# Altium schematic sheet MeasurementCircuit.SchDoc
size 322 x 215 mm; SheetNumber: 2; SheetTotal: 2
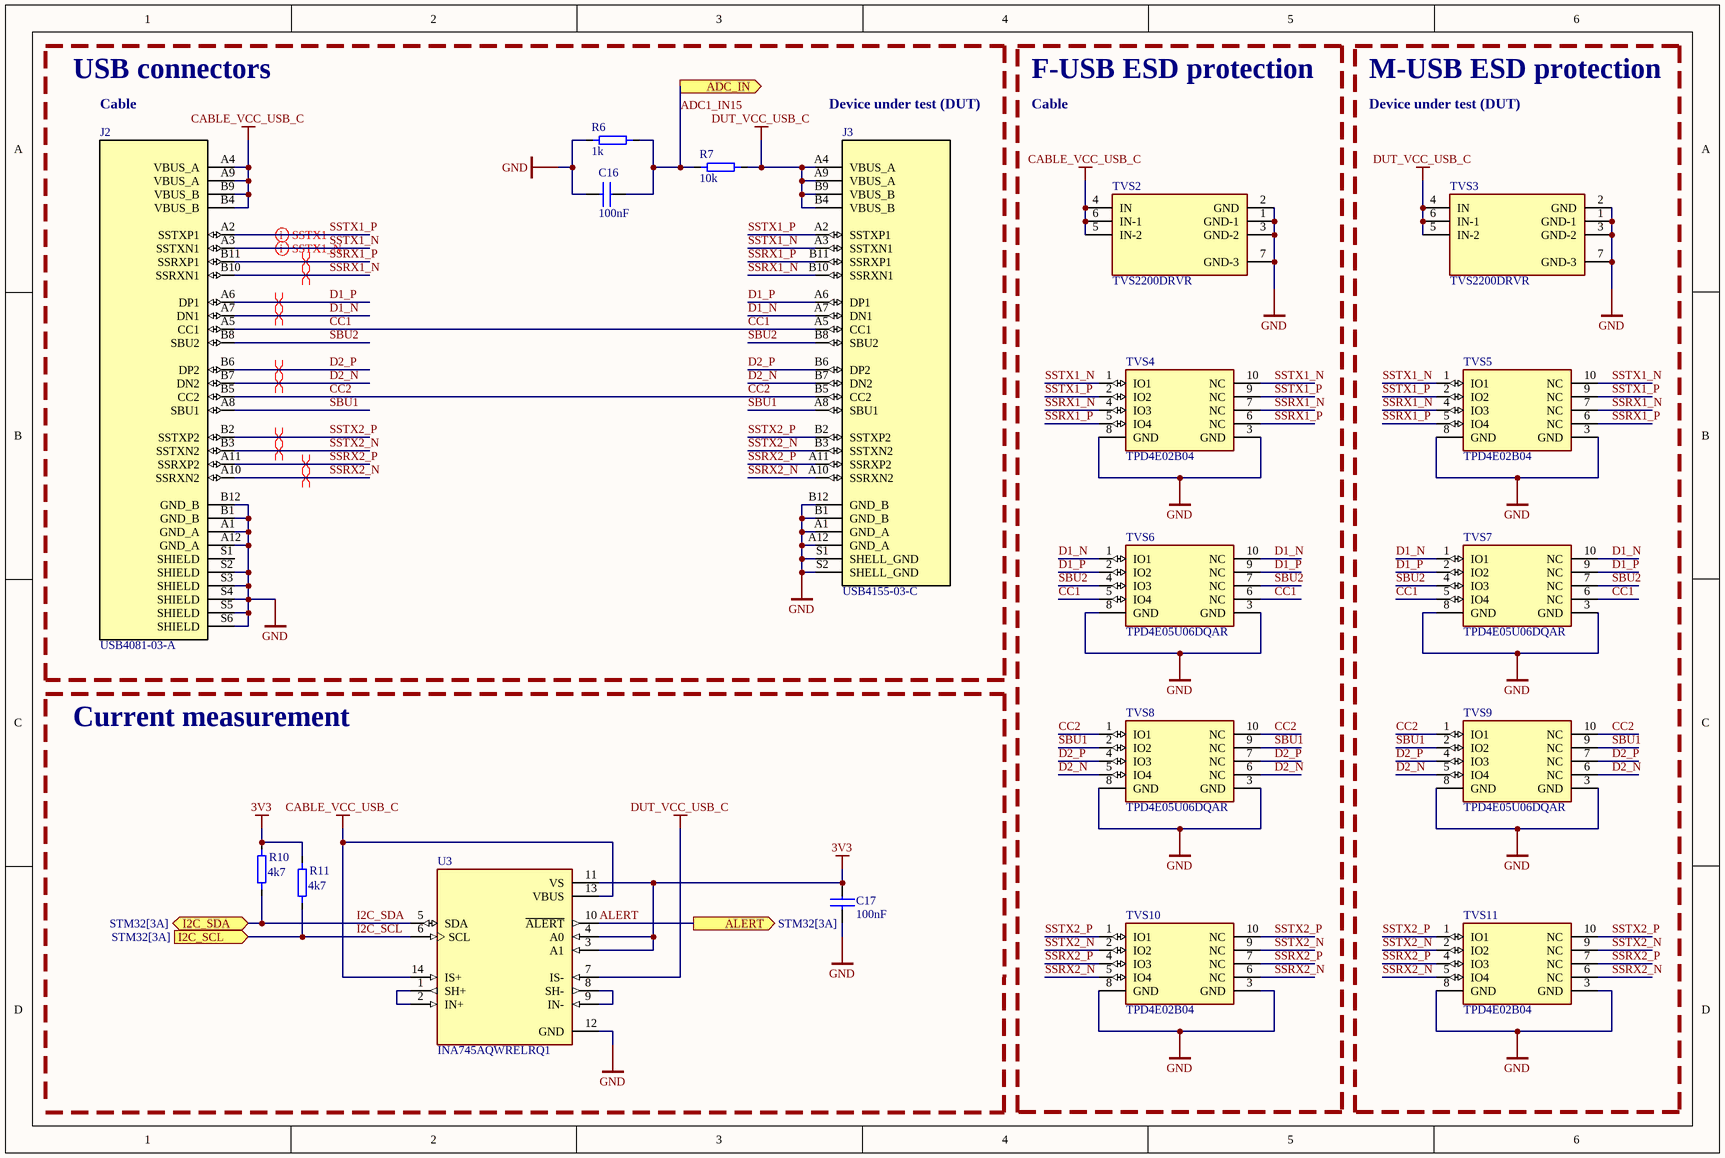
[diagram p0: MeasurementCircuit.SchDoc]

## Parts
C16  100nF  [C0402]
C17  100nF  [C0402]
J2  USB4081-03-A  [USB4081-03-A]
J3  USB4155-03-C  [USB4155-03-C]
R6  1k  [R0402]
R7  10k  [R0603]
R10  4k7  [R0402]
R11  4k7  [R0402]
TVS2  TVS2200DRVR  [TVS2200DRVR]
TVS3  TVS2200DRVR  [TVS2200DRVR]
TVS4  TPD4E02B04  [TPD4E02B04]
TVS5  TPD4E02B04  [TPD4E02B04]
TVS6  TPD4E05U06DQAR  [TPD4E05U06DQAR]
TVS7  TPD4E05U06DQAR  [TPD4E05U06DQAR]
TVS8  TPD4E05U06DQAR  [TPD4E05U06DQAR]
TVS9  TPD4E05U06DQAR  [TPD4E05U06DQAR]
TVS10  TPD4E02B04  [TPD4E02B04]
TVS11  TPD4E02B04  [TPD4E02B04]
U3  INA745AQWRELRQ1  [INA745AQWRELRQ1]

## Blocks framed on the sheet
USB connectors: C16 J2 J3 R6 R7
F-USB ESD protection: TVS2 TVS4 TVS6 TVS8 TVS10
M-USB ESD protection: TVS3 TVS5 TVS7 TVS9 TVS11

## Ports
ADC_IN (out, see STM32[2B]), ALERT (out, see STM32[3A]), I2C_SCL (in, see STM32[3A]), I2C_SDA (bidir, see STM32[3A])

## Nets
3V3: C17.1 R10.1 R11.1 U3.3(A1) U3.4(A0) U3.11(VS)
CABLE_VCC_USB_C: J2.A4(VBUS_A) J2.A9(VBUS_A) J2.B4(VBUS_B) J2.B9(VBUS_B) TVS2.4(IN) TVS2.5(IN-2) TVS2.6(IN-1) U3.13(VBUS) U3.14(IS+)
DUT_VCC_USB_C: J3.A4(VBUS_A) J3.A9(VBUS_A) J3.B4(VBUS_B) J3.B9(VBUS_B) R7.2 TVS3.4(IN) TVS3.5(IN-2) TVS3.6(IN-1) U3.7(IS-)
GND: C16.2 C17.2 J2.A1(GND_A) J2.A12(GND_A) J2.B1(GND_B) J2.B12(GND_B) J2.S2(SHIELD) J2.S3(SHIELD) J2.S4(SHIELD) J2.S5(SHIELD) J2.S6(SHIELD) J3.A1(GND_A) J3.A12(GND_A) J3.B1(GND_B) J3.B12(GND_B) J3.S1(SHELL_GND) J3.S2(SHELL_GND) R6.1 TVS2.1(GND-1) TVS2.2(GND) TVS2.3(GND-2) TVS2.7(GND-3) TVS3.1(GND-1) TVS3.2(GND) TVS3.3(GND-2) TVS3.7(GND-3) TVS4.3(GND) TVS4.8(GND) TVS5.3(GND) TVS5.8(GND) TVS6.3(GND) TVS6.8(GND) TVS7.3(GND) TVS7.8(GND) TVS8.3(GND) TVS8.8(GND) TVS9.3(GND) TVS9.8(GND) TVS10.3(GND) TVS10.8(GND) TVS11.3(GND) TVS11.8(GND) U3.12(GND)
ADC1_IN15: C16.1 R6.2 R7.1 ; port ADC_IN
ALERT: U3.10(~{ALERT}) ; port ALERT
CC1: J2.A5(CC1) J3.A5(CC1) TVS6.5(IO4) TVS6.6(NC) TVS7.5(IO4) TVS7.6(NC)
CC2: J2.B5(CC2) J3.B5(CC2) TVS8.1(IO1) TVS8.10(NC) TVS9.1(IO1) TVS9.10(NC)
D1_N: J2.A7(DN1) J3.A7(DN1) TVS6.1(IO1) TVS6.10(NC) TVS7.1(IO1) TVS7.10(NC)
D1_P: J2.A6(DP1) J3.A6(DP1) TVS6.2(IO2) TVS6.9(NC) TVS7.2(IO2) TVS7.9(NC)
D2_N: J2.B7(DN2) J3.B7(DN2) TVS8.5(IO4) TVS8.6(NC) TVS9.5(IO4) TVS9.6(NC)
D2_P: J2.B6(DP2) J3.B6(DP2) TVS8.4(IO3) TVS8.7(NC) TVS9.4(IO3) TVS9.7(NC)
I2C_SCL: R11.2 U3.6(SCL) ; port I2C_SCL
I2C_SDA: R10.2 U3.5(SDA) ; port I2C_SDA
SBU1: J2.A8(SBU1) J3.A8(SBU1) TVS8.2(IO2) TVS8.9(NC) TVS9.2(IO2) TVS9.9(NC)
SBU2: J2.B8(SBU2) J3.B8(SBU2) TVS6.4(IO3) TVS6.7(NC) TVS7.4(IO3) TVS7.7(NC)
SSRX1_N: J2.B10(SSRXN1) J3.B10(SSRXN1) TVS4.4(IO3) TVS4.7(NC) TVS5.4(IO3) TVS5.7(NC)
SSRX1_P: J2.B11(SSRXP1) J3.B11(SSRXP1) TVS4.5(IO4) TVS4.6(NC) TVS5.5(IO4) TVS5.6(NC)
SSRX2_N: J2.A10(SSRXN2) J3.A10(SSRXN2) TVS10.5(IO4) TVS10.6(NC) TVS11.5(IO4) TVS11.6(NC)
SSRX2_P: J2.A11(SSRXP2) J3.A11(SSRXP2) TVS10.4(IO3) TVS10.7(NC) TVS11.4(IO3) TVS11.7(NC)
SSTX1_N: J2.A3(SSTXN1) J3.A3(SSTXN1) TVS4.1(IO1) TVS4.10(NC) TVS5.1(IO1) TVS5.10(NC)
SSTX1_P: J2.A2(SSTXP1) J3.A2(SSTXP1) TVS4.2(IO2) TVS4.9(NC) TVS5.2(IO2) TVS5.9(NC)
SSTX2_N: J2.B3(SSTXN2) J3.B3(SSTXN2) TVS10.2(IO2) TVS10.9(NC) TVS11.2(IO2) TVS11.9(NC)
SSTX2_P: J2.B2(SSTXP2) J3.B2(SSTXP2) TVS10.1(IO1) TVS10.10(NC) TVS11.1(IO1) TVS11.10(NC)
NetU3_1: U3.1(SH+) U3.2(IN+)
NetU3_8: U3.8(SH-) U3.9(IN-)

Not connected (* = marked no-connect by the designer): J2 S1(SHIELD)

## Layout directives
differential pair: D1_N, D1_P, D2_N, D2_P, SSRX1_N, SSRX1_P, SSRX2_N, SSRX2_P, SSTX1_N, SSTX1_P, SSTX2_N, SSTX2_P

## Notes on the sheet
- Cable
- Device under test (DUT)
- Current measurement

## Library data of the parts
C16 C17 = C: Kondensator ceramiczny SMD; Supplier: *; SupplierURL: *; helpurl: *; Manufacturer: *; PartNumber: *; Price: *; Symbol: *; Package: *; Voltage: *; Value: 100nF
J2 = USB4081-03-A: Type C USB 3.2 Gen 2 Connector
J3 = USB4155-03-C: USB-C (USB TYPE-C) USB 3.2 Gen 2 (USB 3.1 Gen 2, Superspeed + (USB 3.1)) Receptacle Connector 24 Position Surface Mount, Right Angle; Through Hole
R6 R7 R10 R11 = R: Rezystor SMD; Supplier: *; SupplierURL: *; helpurl: *; Manufacturer: *; PartNumber: *; Price: *; Symbol: *; Package: *
  R6: Value: 1k
  R7: Value: 10k
  R10 R11: Value: 4k7
TVS2 TVS3 = TVS2200DRVR: 22V flat-clamp surge protection device; ComponentLink1Description: New link; ComponentLink1URL: https://www.mouser.pl/ProductDetail/Texas-Instruments/TVS2200DRVR?qs=W0yvOO0ixfHPbvei2cYdIw%3D%3D
TVS6-TVS9 = TPD4E05U06DQAR: ESD Protection Diodes / TVS Diodes 0.66-pF +/-3.6-V +/- 30-kV ESD protectio; ComponentLink1Description: New link; ComponentLink1URL: https://www.mouser.pl/ProductDetail/Texas-Instruments/TPD4E05U06DQAR?qs=%2FCrDlo5IrVPi4woOvWz0qA%3D%3D
U3 = INA745AQWRELRQ1: AEC-Q100 40V 16-bit high-precision I²C output digital power monitor with 800-µΩ EZShunt™ Technology; ComponentLink1Description: New link; ComponentLink1URL: https://www.digikey.com/en/products/detail/texas-instruments/INA745AQWRELRQ1/28022225
TVS4 TVS5 TVS10 TVS11 = TPD4E02B04: ComponentLink1Description: New link; ComponentLink1URL: https://www.mouser.pl/ProductDetail/Texas-Instruments/TPD4E02B04DQAR?qs=8%2FmU9qzJpL%2FFVYtHO1iV9g%3D%3D